# EAGLE design Placa ATMEL 2019 v2 (EAGLE 7.6.0)
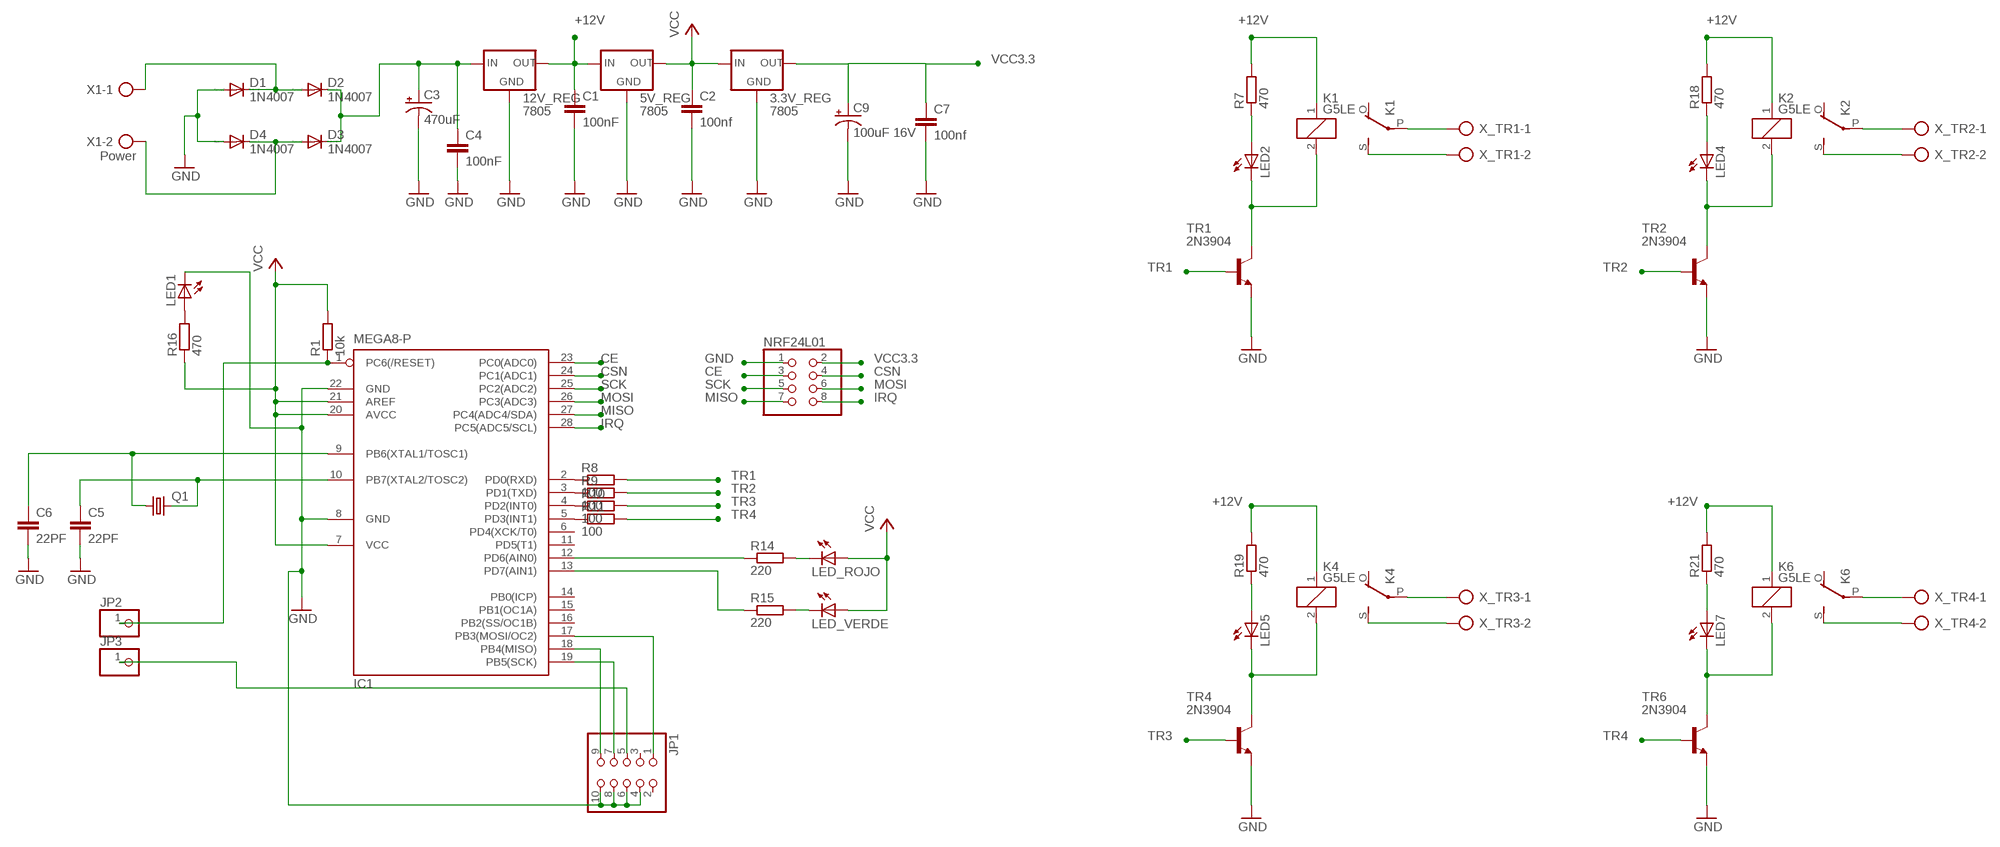
[diagram p0: schematic, sheet 1]

## Parts
3.3V_REG  7805  78XXL  [78XXL]
5V_REG  7805  78XXL  [78XXL]
12V_REG  7805  78XXL  [78XXL]
C1  100nF  C-EU050-025X075  [C050-025X075]
C2  100nf  C-EU050-025X075  [C050-025X075]
C3  470uF  CPOL-USE7.5-16  [E7,5-16]
C4  100nF  C-EU050-025X075  [C050-025X075]
C5  22PF  C-EU050-024X044  [C050-024X044]
C6  22PF  C-EU050-024X044  [C050-024X044]
C7  100nf  C-EU050-025X075  [C050-025X075]
C9  100uF 16V  CPOL-USE2.5-7  [E2,5-7]
D1  1N4007  1N4004  [DO41-10]
D2  1N4007  1N4004  [DO41-10]
D3  1N4007  1N4004  [DO41-10]
D4  1N4007  1N4004  [DO41-10]
IC1  MEGA8-P  [DIL28-3]
JP1  PINHD-2X5  [2X05]
JP2  PINHD-1X1  [1X01]
JP3  PINHD-1X1  [1X01]
K1  G5LE  [G5LE]
K2  G5LE  [G5LE]
K4  G5LE  [G5LE]
K6  G5LE  [G5LE]
LED1  LED5MM  [LED5MM]
LED2  LED5MM  [LED5MM]
LED4  LED5MM  [LED5MM]
LED5  LED5MM  [LED5MM]
LED7  LED5MM  [LED5MM]
LED_ROJO  LED5MM  [LED5MM]
LED_VERDE  LED5MM  [LED5MM]
NRF24L01  PINHD-2X4  [2X04]
Q1  CRYSTALHC49S  [HC49/S]
R1  10k  R-EU_0207/10  [0207/10]
R7  470  R-EU_0309/10  [0309/10]
R8  100  R-EU_0207/10  [0207/10]
R9  100  R-EU_0207/10  [0207/10]
R10  100  R-EU_0207/15  [0207/15]
R11  100  R-EU_0207/10  [0207/10]
R14  220  R-EU_0207/10  [0207/10]
R15  220  R-EU_0207/10  [0207/10]
R16  470  R-EU_0309/10  [0309/10]
R18  470  R-EU_0309/10  [0309/10]
R19  470  R-EU_0309/10  [0309/10]
R21  470  R-EU_0309/10  [0309/10]
TR1  2N3904  [TO92]
TR2  2N3904  [TO92]
TR4  2N3904  [TO92]
TR6  2N3904  [TO92]
X1  Power  AK500/2  [AK500/2]
X_TR1  AK300/2  [AK300/2]
X_TR2  AK300/2  [AK300/2]
X_TR3  AK300/2  [AK300/2]
X_TR4  AK300/2  [AK300/2]

## Nets
+12V: 5V_REG.IN 12V_REG.OUT C1.1 K1.1 K2.1 K4.1 K6.1 R7.2 R18.2 R19.2 R21.2
CE: IC1.23(PC0(ADC0)) NRF24L01.3
CSN: IC1.24(PC1(ADC1)) NRF24L01.4
GND: 3.3V_REG.GND 5V_REG.GND 12V_REG.GND C1.2 C2.2 C3.- C4.2 C5.2 C6.2 C7.2 C9.- D1.A D4.A IC1.8(GND) IC1.22(GND) JP1.4 JP1.6 JP1.8 JP1.10 LED1.K(C) NRF24L01.1 TR1.3(E) TR2.3(E) TR4.3(E) TR6.3(E)
IRQ: IC1.28(PC5(ADC5/SCL)) NRF24L01.8
MISO: IC1.27(PC4(ADC4/SDA)) NRF24L01.7
MOSI: IC1.26(PC3(ADC3)) NRF24L01.6
N$1: JP1.5 JP3.1
N$2: 12V_REG.IN C3.+ C4.1 D2.C D3.C
N$3: K4.S(2:S) X_TR3.2
N$4: K1.S(2:S) X_TR1.2
N$5: K2.S(2:S) X_TR2.2
N$6: LED2.A R7.1
N$7: IC1.2(PD0(RXD)) R8.1
N$8: IC1.3(PD1(TXD)) R9.1
N$9: IC1.4(PD2(INT0)) R10.1
N$10: IC1.5(PD3(INT1)) R11.1
N$11: LED_ROJO.K(C) R14.2
N$12: LED_VERDE.K(C) R15.2
N$13: IC1.12(PD6(AIN0)) R14.1
N$14: IC1.13(PD7(AIN1)) R15.1
N$15: K6.S(2:S) X_TR4.2
N$16: IC1.17(PB3(MOSI/OC2)) JP1.1
N$17: LED1.A R16.2
N$18: IC1.19(PB5(SCK)) JP1.7
N$19: IC1.18(PB4(MISO)) JP1.9
N$24: D1.C D2.A X1.1
N$29: K1.2 LED2.K(C) TR1.1(C)
N$32: K1.P(2:P) X_TR1.1
N$65: D3.A D4.C X1.2
N$71: LED4.A R18.1
N$81: K2.2 LED4.K(C) TR2.1(C)
N$84: K2.P(2:P) X_TR2.1
N$85: LED5.A R19.1
N$86: K4.2 LED5.K(C) TR4.1(C)
N$89: K4.P(2:P) X_TR3.1
N$111: IC1.1(PC6(/RESET)) JP2.1 R1.1
N$118: LED7.A R21.1
N$135: C5.1 IC1.10(PB7(XTAL2/TOSC2)) Q1.2
N$136: C6.1 IC1.9(PB6(XTAL1/TOSC1)) Q1.1
N$138: K6.2 LED7.K(C) TR6.1(C)
N$148: K6.P(2:P) X_TR4.1
SCK: IC1.25(PC2(ADC2)) NRF24L01.5
TR1: R8.2 TR1.2(B)
TR2: R9.2 TR2.2(B)
TR3: R10.2 TR4.2(B)
TR4: R11.2 TR6.2(B)
VCC: 3.3V_REG.IN 5V_REG.OUT C2.1 IC1.7(VCC) IC1.20(AVCC) IC1.21(AREF) LED_ROJO.A LED_VERDE.A R1.2 R16.1
VCC3.3: 3.3V_REG.OUT C7.1 C9.+ NRF24L01.2
Unconnected: IC1.6(PD4(XCK/T0)) IC1.11(PD5(T1)) IC1.14(PB0(ICP)) IC1.15(PB1(OC1A)) IC1.16(PB2(SS/OC1B)) JP1.2 JP1.3 K1.O(2:O) K2.O(2:O) K4.O(2:O) K6.O(2:O)

## Library data of the parts
3.3V_REG 5V_REG 12V_REG = v-reg:78XXL: VOLTAGE REGULATOR
C1 C2 C4-C7 = rcl:C-EU: CAPACITOR, European symbol
C3 C9 = rcl:CPOL-US: POLARIZED CAPACITOR, American symbol
D1-D4 = diode:1N4004: DIODE general purpose rectifier, 1 A
IC1 = atmel:MEGA8-P: MICROCONTROLLER 8 Kbytes FLASH, 1 kbytes SRAM, 512 bytes EEPROM, USART, 4-channel 10 bit ADC, 2-channel 8 bit ADC Pin compatible with Atmega48, ATMega88, ATMega168 Source: avr.lbr; OC_FARNELL: unknown; OC_NEWARK: unknown
JP1 = pinhead:PINHD-2X5: PIN HEADER
JP2 JP3 = pinhead:PINHD-1X1: PIN HEADER
K1 K2 K4 K6 = relay:G5LE: RELAY 1 x switch, 10 A/120 V AC, 8 A/30 V DC, Omron; OC_FARNELL: unknown; OC_NEWARK: unknown
LED1 LED2 LED4 LED5 LED7 LED_ROJO LED_VERDE = led:LED: LED OSRAM: - CHIPLED LG R971, LG N971, LY N971, LG Q971, LY Q971, LO R971, LY R971 LH N974, LH R974 LS Q976, LO Q976, LY Q976 LO Q996 - Hyper CHIPLED LW Q18S LB Q993, LB Q99A, LB R99A - SideLED LS A670, LO A670, LY A670, LG A670, LP A670 LB A673, LV A673, LT A673, LW A673 LH A674 LY A675 LS A676, LA A676, LO A676, LY A676, LW A676 LS A679, LY A679, LG A679 - Hyper Micro SIDELED® LS Y876, LA Y876, LO Y876, LY Y876 LT Y87S - SmartLED LW L88C, LW L88S LB L89C, LB L89S, LG L890 LS L89K, LO L89K, LY L89K LS L896, LA L896, LO L896, LY L896 - TOPLED LS T670, LO T670, LY T670, LG T670, LP T670 LSG T670, LSP T670, LSY T670, LOP T670, LYG T670 LG T671, LOG T671, LSG T671 LB T673, LV T673, LT T673, LW T673 LH T674 LS T676, LA T676, LO T676, LY T676, LB T676, LH T676, LSB T676, LW T676 LB T67C, LV T67C, LT T67C, LS T67K, LO T67K, LY T67K, LW E67C LS E67B, LA E67B, LO E67B, LY E67B, LB E67C, LV E67C, LT E67C LW T67C LS T679, LY T679, LG T679 LS T770, LO T770, LY T770, LG T770, LP T770 LB T773, LV T773, LT T773, LW T773 LH T774 LS E675, LA E675, LY E675, LS T675 LS T776, LA T776, LO T776, LY T776, LB T776 LHGB T686 LT T68C, LB T68C - Hyper Mini TOPLED® LB M676 - Mini TOPLED Santana® LG M470 LS M47K, LO M47K, LY M47K Source: http://www.osram.convergy.de LUXEON: - LUMILED® LXK2-PW12-R00, LXK2-PW12-S00, LXK2-PW14-U00, LXK2-PW14-V00 LXK2-PM12-R00, LXK2-PM12-S00, LXK2-PM14-U00 LXK2-PE12-Q00, LXK2-PE12-R00, LXK2-PE12-S00, LXK2-PE14-T00, LXK2-PE14-U00 LXK2-PB12-K00, LXK2-PB12-L00, LXK2-PB12-M00, LXK2-PB14-N00, LXK2-PB14-P00, LXK2-PB14-Q00 LXK2-PR12-L00, LXK2-PR12-M00, LXK2-PR14-Q00, LXK2-PR14-R00 LXK2-PD12-Q00, LXK2-PD12-R00, LXK2-PD12-S00 LXK2-PH12-R00, LXK2-PH12-S00 LXK2-PL12-P00, LXK2-PL12-Q00, LXK2-PL12-R00 Source: www.luxeon.com KINGBRIGHT: KA-3528ASYC Source: www.kingbright.com
NRF24L01 = pinhead:PINHD-2X4: PIN HEADER
Q1 = crystal:CRYSTAL: CRYSTAL; OC_FARNELL: 1667008; OC_NEWARK: unknown
R1 R7-R11 R14-R16 R18 R19 R21 = rcl:R-EU_: RESISTOR, European symbol
TR1 TR2 TR4 TR6 = transistor-npn:2N3904: NPN Transistor
X1 = con-ptr500:AK500/2: CONNECTOR; OC_FARNELL: unknown; OC_NEWARK: unknown
X_TR1-X_TR4 = con-ptr500:AK300/2: CONNECTOR; OC_FARNELL: unknown; OC_NEWARK: unknown

## Board
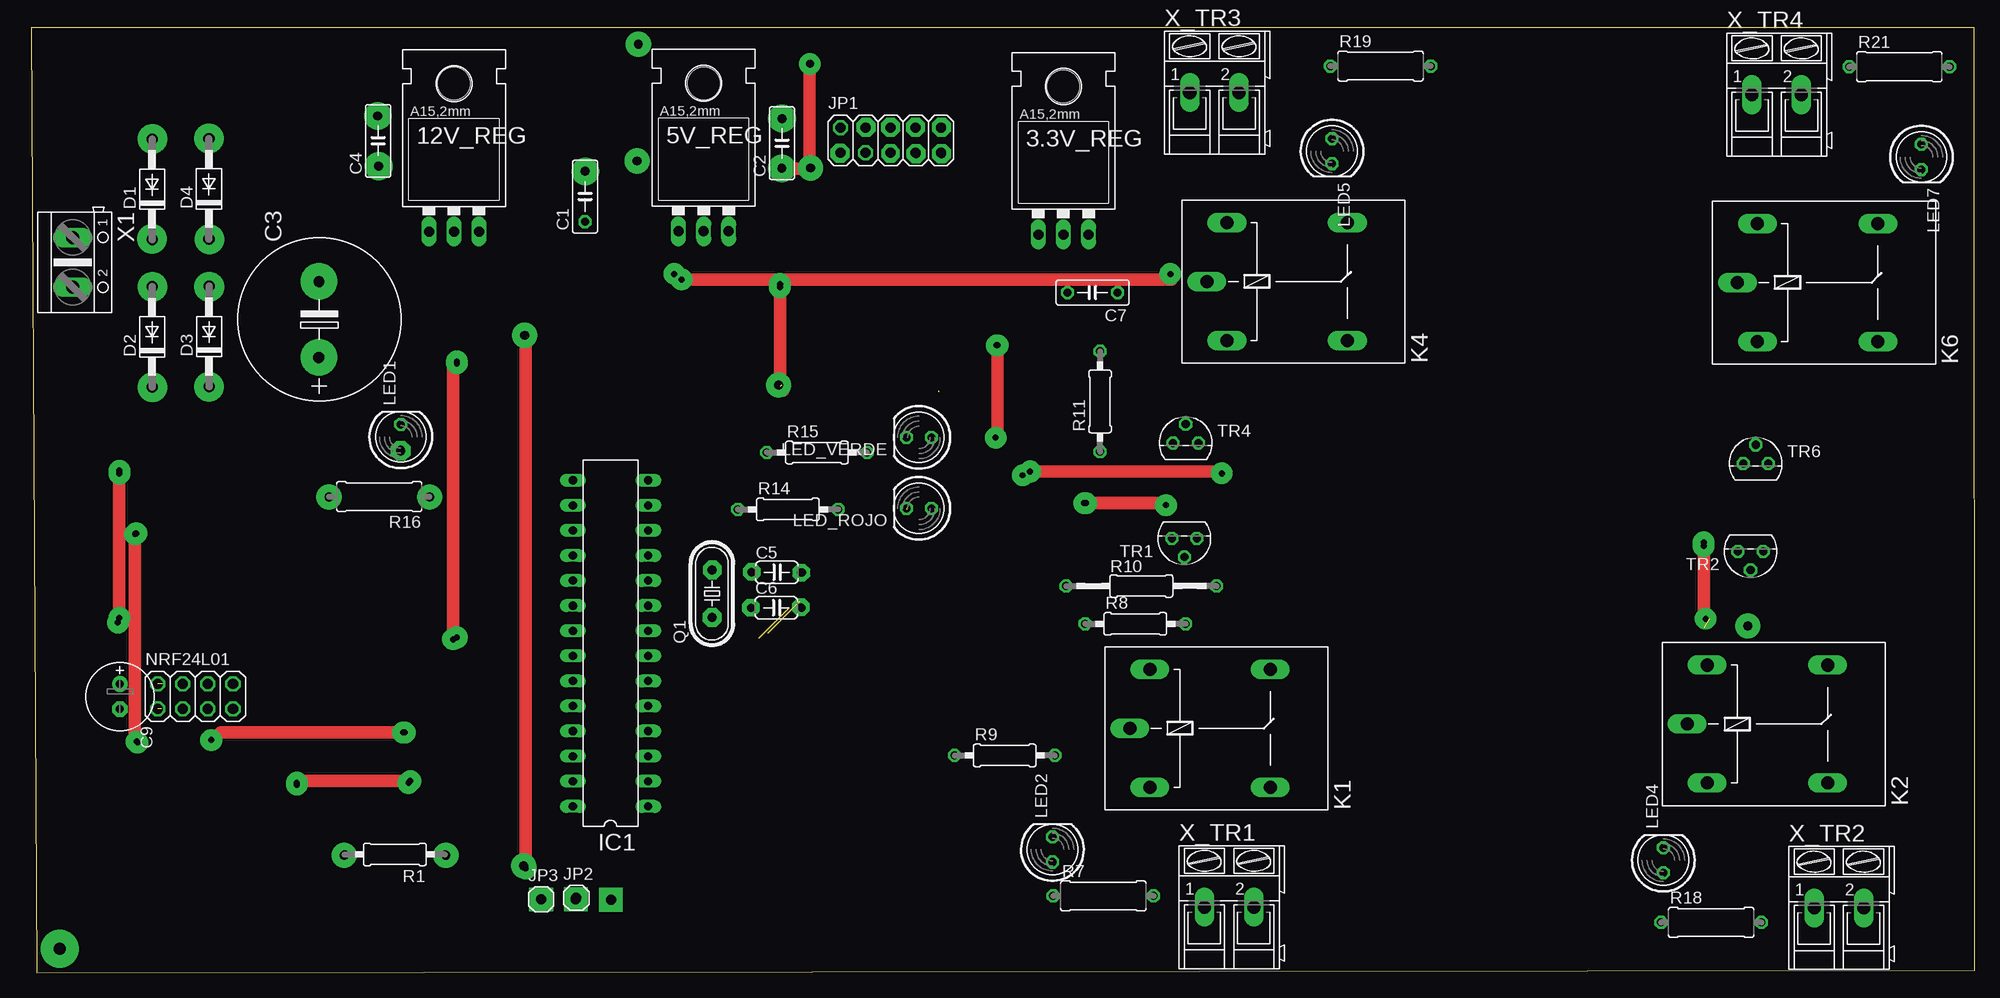
[diagram p1: board, top side]
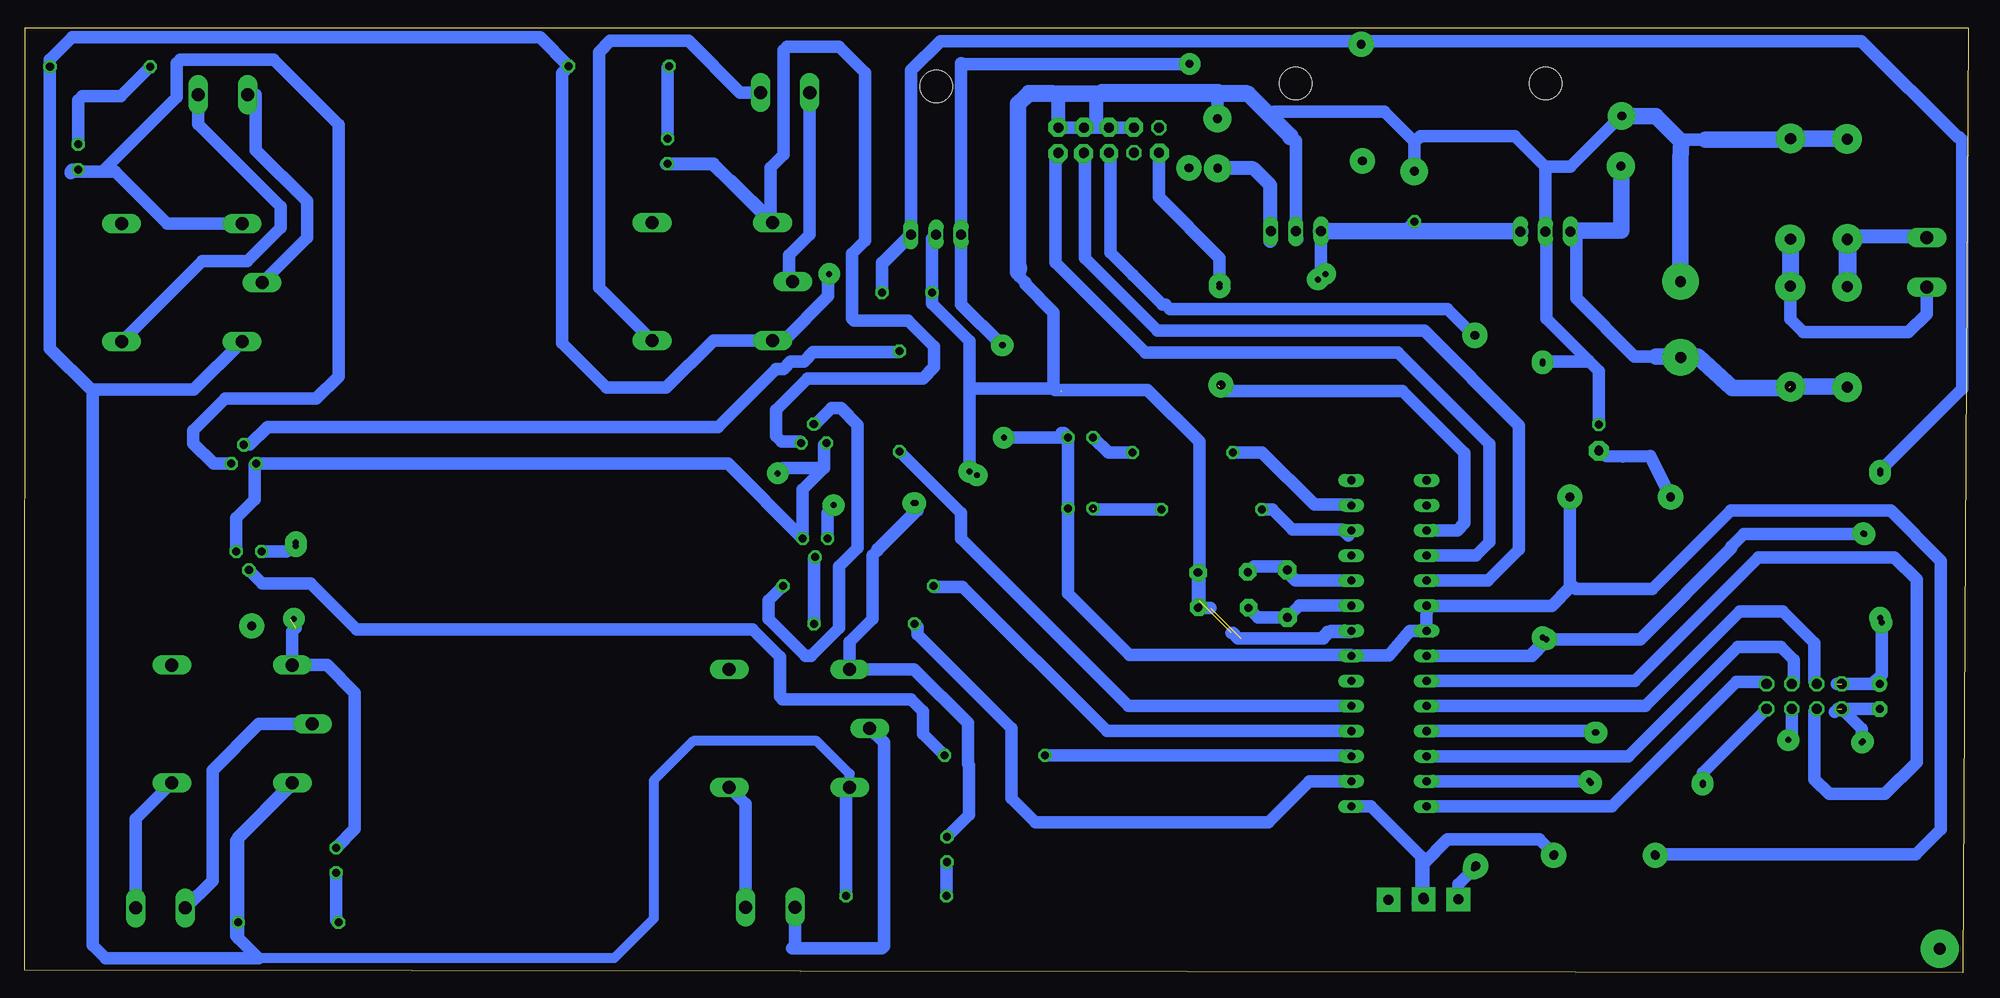
[diagram p2: board, bottom side, seen from below]

Size 196.74 x 95.72 mm. Coordinates in mm from the lower left corner, seen from the top.
Outline: 0.57,0 196.74,0.28 196.7,95.72 0,95.7 0.57,0
Copper layers (1*16): Top 0.035mm / dielectric 1.5mm / Bottom 0.035mm
Design rules "default *": minimum track width 10mil, minimum drill 24mil, track to track 1mm, track to pad 1mm, pad to pad 1mm, via to via 1mm, smd to smd 1mm, copper to edge 1mm, drill to drill 1mm, minimum pad ring 10mil, minimum via ring 8mil, stop-mask expansion 4mil, vias tented up to drill 0mil, thermal gap 10mil

### Footprints (pad centres in the part's own frame; a part is rotated, then mirrored left to right if it is on the bottom)
78XXL = drill 1.016 long: GND 0,-3.81; IN -2.54,-3.81; OUT 2.54,-3.81 | hole 3.302: 0,11.176
C050-025X075 = drill 0.813 octagon: 1 -2.54,0; 2 2.54,0
E7,5-16 = drill 1.016 pad 3.15: + -3.81,0 | drill 1.016 pad 3.15 octagon: - 3.81,0
C050-024X044 = drill 0.813 octagon: 1 -2.54,0; 2 2.54,0
E2,5-7 = drill 0.813 pad 1.6: + -1.27,0 | drill 0.813 pad 1.6 octagon: - 1.27,0
DO41-10 = drill 1.118: A 5.08,0; C -5.08,0
DIL28-3 = drill 0.813 long: 1 -16.51,-3.81; 2 -13.97,-3.81; 3 -11.43,-3.81; 4 -8.89,-3.81; 5 -6.35,-3.81; 6 -3.81,-3.81; 7 -1.27,-3.81; 8 1.27,-3.81; 9 3.81,-3.81; 10 6.35,-3.81; 11 8.89,-3.81; 12 11.43,-3.81; 13 13.97,-3.81; 14 16.51,-3.81; 15 16.51,3.81; 16 13.97,3.81; 17 11.43,3.81; 18 8.89,3.81; 19 6.35,3.81; 20 3.81,3.81; 21 1.27,3.81; 22 -1.27,3.81; 23 -3.81,3.81; 24 -6.35,3.81; 25 -8.89,3.81; 26 -11.43,3.81; 27 -13.97,3.81; 28 -16.51,3.81
2X05 = drill 1.016 octagon: 1 -5.08,-1.27; 2 -5.08,1.27; 3 -2.54,-1.27; 4 -2.54,1.27; 5 0,-1.27; 6 0,1.27; 7 2.54,-1.27; 8 2.54,1.27; 9 5.08,-1.27; 10 5.08,1.27
1X01 = drill 1.016 octagon: 1 0,0
G5LE = drill 1.321 long: 1 -7.493,-5.969; 2 -7.493,5.969; O 4.699,5.969; P -9.525,0; S 4.699,-5.969
LED5MM = drill 0.813 octagon: A -1.27,0; K 1.27,0
2X04 = drill 1.016 octagon: 1 -3.81,-1.27; 2 -3.81,1.27; 3 -1.27,-1.27; 4 -1.27,1.27; 5 1.27,-1.27; 6 1.27,1.27; 7 3.81,-1.27; 8 3.81,1.27
HC49/S = drill 0.813: 1 -2.413,0; 2 2.413,0
0207/10 = drill 0.813 octagon: 1 -5.08,0; 2 5.08,0
0309/10 = drill 0.813 octagon: 1 -5.08,0; 2 5.08,0
0207/15 = drill 0.813 octagon: 1 -7.62,0; 2 7.62,0
TO92 = drill 0.813 octagon: 1 1.27,0; 2 0,1.905; 3 -1.27,0
AK500/2 = drill 1.321 long: 1 -2.515,0; 2 2.515,0
AK300/2 = drill 1.321 long: 1 -2.515,0; 2 2.489,0

### Placement (x,y rotation side)
3.3V_REG  104.48,78.59 0 top
5V_REG  68.06,78.91 0 top
12V_REG  42.79,78.88 0 top
C1  56.05,78.61 90 top
C2  75.98,84.02 90 top
C3  29.15,66.17 90 top
C4  35.11,84.26 90 top
C5  75.47,40.56 0 top
C6  75.42,36.98 0 top
C7  107.43,68.9 180 top
C9  8.97,27.99 270 top
D1  12.22,79.36 90 top
D2  12.23,64.42 90 top
D3  17.99,64.45 90 top
D4  17.98,79.4 90 top
IC1  58.63,33.38 90 top
JP1  86.99,84.31 0 top
JP2  55.17,7.6 0 top
JP3  51.62,7.46 0 top
K1  120.73,24.78 0 top
K2  177.15,25.2 0 top
K4  128.53,70.02 0 top
K6  182.23,69.92 0 top
LED1  37.4,54.28 90 top
LED2  103.37,12.5 90 top
LED4  165.21,11.42 90 top
LED5  131.67,83.22 270 top
LED7  191.34,82.63 270 top
LED_ROJO  89.85,47.05 180 top
LED_VERDE  89.85,54.23 180 top
NRF24L01  16.6,28 0 top
Q1  68.9,38.41 90 top
R1  36.8,12 180 top
R7  108.52,7.8 0 top
R8  111.76,35.35 0 top
R9  98.54,22.03 0 top
R10  112.37,39.18 0 top
R11  108.19,57.87 90 top
R14  76.59,46.94 0 top
R15  79.52,52.7 0 top
R16  35.22,48.24 180 top
R18  170.05,5.12 0 top
R19  136.58,91.83 0 top
R21  189.1,91.76 0 top
TR1  116.72,44.01 180 top
TR2  174.04,42.7 180 top
TR4  116.86,53.66 0 top
TR6  174.56,51.58 0 top
X1  4.19,71.96 270 top
X_TR1  121.26,6.66 0 top
X_TR2  182.99,6.58 0 top
X_TR3  119.78,89.14 0 top
X_TR4  176.7,88.93 0 top

### Tracks (layer width: path | path; a pad name or v marks a point on that pad's centre or on a via)
+12V  (via drill 0.6 pad 2.18)  (1 unrouted)
  Top 1.27: v65.83,70.22 115.41,70.22 115.42,70.21
  Bottom 1.016: K1.1 113.24,20.17 116.57,23.5 129.07,23.5 133.07,19.5 133.07,5.5 137.07,1.5 173.06,1.5 173.07,1.51
  Bottom 1.27: 173.46,1.86 175.13,3.53 R18.2 175.13,13.76 K2.1 169.66,19.07 175.33,13.4 175.33,3.77 173.07,1.51 188.52,1.51 189.84,2.83 189.84,58.7 189.46,59.08 | C1.1 57.02,75.1 60.56,75.1 | R7.2 113.6,18.45 K1.1 | 189.46,59.08 190.03,59.08 194.18,63.23 R21.2 194.18,92.48 191.91,94.75 144.58,94.75 R19.2 142.36,91.13 142.36,63.8 137.83,59.27 131.81,59.27 127.03,64.05 K4.1 119.89,64.05 115.42,68.52 115.42,70.21 115.23,70.4 | 189.46,59.08 179.61,59.08 K6.1 | 5V_REG.IN 65.52,70.84 65.27,70.59 65.46,70.59 v65.83,70.22
  Bottom 1.676: 5V_REG.IN 60.56,75.1 45.33,75.1 12V_REG.OUT
CE
  Bottom 1.27: IC1.23 33.75,29.57 21.23,42.09 7.47,42.09 5.21,39.83 5.21,21.33 8.42,18.12 14.07,18.12 15.58,19.63 15.58,26.48 NRF24L01.3
CSN
  Bottom 1.27: IC1.24 32.7,27.03 23.11,36.62 18.79,36.62 15.58,33.41 15.58,29.52 NRF24L01.4
GND  (via drill 0.6 pad 2.18)  (4 unrouted)
  Top 1.27: v42.7,33.79 42.7,61.53 v43.08,61.91 | v101.11,50.78 120.32,50.78 120.7,50.4 | v10.49,44.44 10.49,23.6 v10.76,23.33
  Bottom 1.27: JP1.4 JP1.6 87.98,85.58 | 87.98,85.58 JP1.8 JP1.10 92.07,88.63 92.7,89.26 95.19,89.26 96.1,88.35 96.1,70.54 95.45,69.89 95.45,69.76 92.57,66.88 92.57,59.16 | C5.2 77.97,39.82 C6.2 76.7,36.98 | 3.3V_REG.GND 104.89,74.37 C7.2 104.89,67.77 101.11,63.99 101.11,59.42 | 5V_REG.GND 68.06,84.28 70.59,86.81 | 70.59,86.81 73.06,89.28 75.78,89.28 75.98,89.08 C2.2 75.98,89.3 75.89,89.39 87.75,89.39 88.19,88.95 88.19,85.79 87.98,85.58 | 26.61,84.38 28.83,84.38 29.02,84.19 | C1.2 56.05,84.16 | 56.05,84.16 59.09,87.2 70.21,87.2 70.59,86.81 | 42.79,81.63 12V_REG.GND 42.7,74.98 42.7,66.25 38.46,62.01 | 42.79,81.63 45.91,84.75 55.46,84.75 56.05,84.16 | 42.79,81.63 40.28,81.63 C4.2 | LED1.K 37.4,60.95 38.46,62.01 | v43.08,61.91 38.56,61.91 38.46,62.01 | C9.- 13.21,26.72 13.5,26.43 | TR2.3 175.31,46.08 173.45,47.94 173.45,51.42 TR6.3 125.56,51.58 TR1.3 117.99,48.96 115.8,51.15 | 115.8,51.15 115.8,53.45 TR4.3 | 101.11,59.42 v101.11,50.78 100.35,50.02 | 115.8,51.15 119.95,51.15 120.7,50.4 | 73.62,33.9 65.51,33.9 64.86,34.55 62.54,34.55 IC1.8 64.53,34.65 65.28,33.9 73.91,33.9 74.43,34.42 74.56,34.42 | 42.9,33.64 44.43,32.11 IC1.22 44.19,32.11 42.89,33.41 42.89,33.6 v42.7,33.79 33.21,33.79 23.98,43.02 23.98,43.19 22.73,44.44 10.64,44.44 10.49,44.59 v10.49,44.44 | 92.57,59.16 100.85,59.16 101.11,59.42 | 77.83,37.69 77.83,53.8 83.06,59.03 92.44,59.03 92.57,59.16 | v10.76,23.33 10.76,24.7 NRF24L01.1
  Bottom 1.422: 42.83,74.71 12V_REG.GND
  Bottom 1.676: D1.A 12.26,84.48 D4.A 18.08,84.38 26.61,84.38 | C3.- 29.16,82.41 29.02,84.19 31.62,86.75 34.93,86.75 C4.2
IRQ
  Bottom 1.27: IC1.28 36.07,16.87 23.49,29.45 20.59,29.45 NRF24L01.8
MISO  (via drill 0.6 pad 2.18)
  Top 1.27: v38.37,19.44 27.26,19.44 v26.88,19.06
  Bottom 1.27: IC1.27 38.15,19.41 37.99,19.25 v38.18,19.25 v38.37,19.44 | v26.88,19.06 26.88,20.26 NRF24L01.7
MOSI
  Bottom 1.27: IC1.26 34.38,21.95 23.3,33.03 18.97,33.03 17.65,31.71 17.65,29.49 NRF24L01.6
N$1  (via drill 0.6 pad 2.18)  (1 unrouted)
  Top 1.27: v50.05,10.57 50.05,64.26 50.19,64.4
  Bottom 1.27: JP1.5 86.82,82.68 86.82,72.94 84.56,70.68 84.56,70.67 81.58,67.69 81.26,67.69 80.79,67.22 52.7,67.22 50.03,64.55 50.19,64.39 50.19,64.4 49.88,64.71 | JP3.1 51.62,9 v50.05,10.57 50.05,10.76 50.05,10.95
N$2  (1 unrouted)
  Bottom 1.27: 31.64,62.44 33.8,62.44 39.69,68.33 39.69,75.17
  Bottom 1.422: C3.+ 29.43,62.64 | 12V_REG.IN 40.21,75.11
  Bottom 1.676: D2.C 12.26,59.37 D3.C | 18.14,59.22 23.87,59.22 27.37,62.41 C3.+ | 29.43,62.64 29.63,62.44 31.64,62.44 | C4.1 35.11,75.17 39.69,75.17 40.15,75.17 40.21,75.11
N$3
  Bottom 1.27: X_TR3.2 124.31,89.14 129.55,94.38 137.46,94.38 138.6,93.24 138.6,69.42 K4.S
N$4
  Bottom 1.27: X_TR1.2 123.75,17.13 K1.S
N$5
  Bottom 1.27: X_TR2.2 185.48,15.6 K2.S
N$6
  Bottom 1.27: LED2.A 103.44,11.16 R7.1
N$7
  Bottom 1.27: R8.1 106.35,35.02 106.35,34.27 96.84,24.76 96.84,17.67 94.43,15.26 70.85,15.26 66.7,19.41 IC1.2
N$8
  Bottom 1.27: IC1.3 62.52,22.03 R9.1
N$9
  Bottom 1.27: IC1.4 87.2,24.49 101.82,39.11 104.68,39.11 R10.1
N$10
  Bottom 1.27: IC1.5 85.03,27.03 101.98,43.98 101.98,46.58 R11.1
N$11  (1 unrouted)
  Bottom 1.27: 88.62,46.94 88.64,46.96 | R14.2 88.47,46.94 LED_ROJO.K
N$12
  Bottom 1.27: R15.2 87.05,52.7 LED_VERDE.K
N$13
  Bottom 1.27: R14.1 70.42,46.94 68.4,44.92 63.38,44.92 62.75,44.29 62.75,44.3 62.9,44.45 62.8,44.45 IC1.12
N$14
  Bottom 1.27: R15.1 71.47,52.7 66.2,47.43 62.52,47.43 IC1.13
N$15
  Bottom 1.27: X_TR4.2 179.19,85.96 170.81,77.58 170.81,75.49 174.2,72.1 178.78,72.1 K6.S
N$16  (via drill 0.6 pad 2.18)  (1 unrouted)
  Top 1.27: v75.78,69.44 75.78,59.38 75.74,59.34 | 75.74,59.34 75.63,59.23 75.85,59.23 | 75.85,59.23 76.11,58.98 | 75.85,59.23 75.74,59.34
  Bottom 1.27: IC1.17 51.72,44.81 50.98,45.55 50.98,52.63 57.25,58.9 75.3,58.9 75.93,59.53 | JP1.1 81.91,78.54 75.77,72.4 v75.77,69.45 v75.78,69.44
N$17
  Bottom 1.27: R16.2 32.18,52.34 34.96,52.31 36.65,52.33 LED1.A
N$18
  Bottom 1.27: IC1.19 48.63,39.73 45.48,42.88 45.48,55.45 55.06,65.03 82.06,65.03 89.43,72.4 89.43,82.94 JP1.7
N$19
  Bottom 1.27: IC1.18 49.86,42.27 48.47,43.66 48.47,53.57 57.72,62.82 83.3,62.82 92.41,71.93 92.41,82.7 JP1.9
N$20  (via drill 0.6 pad 2.18)
  other vias: 97.62,54.21
N$21  (via drill 0.6 pad 2.18)
  other vias: 97.72,63.56
N$22  (via drill 0.6 pad 2.18)
  other vias: 26.88,19.25
N$23  (via drill 0.9 pad 2)
  other vias: 37.38,52.87
N$24
  Bottom 1.27: X1.1 4.13,74.55 | 11.89,74.28 D1.C
  Bottom 1.422: 4.13,74.55 12.22,74.55 D1.C
  Bottom 1.8: D1.C D2.A
N$25  (via drill 0.6 pad 2.18)
  other vias: 37.62,24.35
N$26  (via drill 0.6 pad 2.18)
  other vias: 18.21,23.59
N$27  (via drill 0.6 pad 2.18)
  other vias: 43.08,33.98
N$28  (via drill 0.6 pad 2.18)
  other vias: 43.08,61.72
N$29  (via drill 0.6 pad 2.18)  (1 unrouted)
  Top 1.27: v106.57,47.57 114.86,47.57 115.05,47.38
  Bottom 1.27: LED2.K 101.13,16.01 101.13,21.02 101.26,21.15 101.26,25.3 106.71,30.75 K1.2 113.24,33.52 110.9,35.86 110.9,42.29 110.43,42.76 | 110.43,42.76 106.38,46.81 106.38,47 | TR1.1 115.45,46.6 115.05,47 115.05,47.38 | 110.43,42.76 110.43,42.95 106.38,47 | 106.38,47 106.38,47.38 v106.57,47.57
N$30  (via drill 0.9 pad 2.54)
  other vias: 78.89,81.52
N$31  (via drill 0.6 pad 2.18)
  other vias: 106.76,47.57
N$32
  Bottom 1.27: K1.P 109.76,23.34 109.76,2.7 109.95,2.51 119.06,2.51 118.74,2.83 X_TR1.1
N$33  (via drill 0.6 pad 2.18)
  other vias: 114.86,47.38
N$34  (via drill 0.6 pad 2.18)
  other vias: 169.3,43.22
N$35  (via drill 0.6 pad 2.18)
  other vias: 169.49,35.86
N$36  (via drill 0.6 pad 2.18)
  other vias: 120.51,50.59
N$38  (via drill 0.9 pad 2.54)
  other vias: 49.85,10.86
N$41  (via drill 1.2 pad 3.81)
  other vias: 2.87,2.45
N$42  (via drill 0.6 pad 2.18)
  other vias: 100.35,50.4
N$43  (via drill 0.9 pad 1.93)
  other vias: 89.49,85.63
N$44  (via drill 0.6 pad 2.18)
  other vias: 115.31,70.78
N$46  (via drill 0.9 pad 2.54)
  other vias: 31.65,11.91
N$47  (via drill 0.9 pad 2.54)
  other vias: 41.97,11.93
N$49  (via drill 0.6 pad 2.18)
  other vias: 65.08,70.78
N$50  (via drill 0.6 pad 2.18)
  other vias: 75.78,69.77
N$51  (via drill 0.6 pad 2.18)
  other vias: 8.92,35.96
N$52  (via drill 0.9 pad 2.54)
  other vias: 75.64,59.53
N$53
  Bottom 1.27: 68.04,74.43 67.92,74.31
N$54
  Bottom 1.422: 52.16,7.11 51.16,7.1
N$55  (via drill 0.9 pad 1.93)
  other vias: 92.15,82.94
N$56  (via drill 0.9 pad 1.93)
  other vias: 81.86,83.01
N$59  (via drill 0.9 pad 1.93)
  other vias: 89.55,82.96
N$60  (via drill 0.9 pad 1.93)
  other vias: 86.99,85.63
N$61  (via drill 0.9 pad 1.93)
  other vias: 92.12,85.63
N$62  (via drill 0.6 pad 2.18)
  other vias: 8.92,50.56
N$64  (via drill 0.9 pad 1.85)
  other vias: 86.98,82.98
N$65
  Bottom 1.27: X1.2 4.18,69.47 4.18,66.7 6.09,64.88 16.68,64.88 17.99,66.19 D3.A
  Bottom 1.7: D3.A D4.C
N$66  (via drill 0.6 pad 2.18)
  other vias: 10.62,44.51
N$67
  Bottom 1.422: 54.66,7.07 55.7,7.08
N$69  (via drill 0.6 pad 2.18)
  other vias: 10.65,23.44
N$71
  Bottom 1.27: R18.1 165.21,5.36 LED4.A
N$81  (via drill 0.6 pad 2.18)  (1 unrouted)
  Top 1.27: v169.3,43.6 169.3,36.43 169.87,35.86
  Bottom 1.27: LED4.K 163.32,14.58 163.32,28.35 166.14,31.17 K2.2 169.66,34.56 169.3,34.92 | TR2.1 170.2,42.7 v169.3,43.6
N$84
  Bottom 1.27: X_TR2.1 177.73,9.32 177.73,20.54 173.07,25.2 K2.P
N$85
  Bottom 1.27: R19.1 131.67,91.66 LED5.A
N$86
  Bottom 1.27: LED5.K 127,81.95 K4.2 121.17,75.99 127.1,81.92 127.11,81.92 | 131.81,81.92 127.11,81.92 | 127.11,81.92 125.41,80.22 125.22,80.22 121.26,76.26 121.26,81.54 119.94,82.86 119.94,93.44 119.57,93.81 114.3,93.81 111.66,91.17 111.66,74.17 112.97,72.86 112.97,66.24 112.79,66.06 107.32,66.06 104.68,63.42 104.68,61.35 105.82,60.21 117.49,60.21 120.7,57 120.7,54.36 120.13,53.79 118.26,53.79 TR4.1
N$87  (via drill 0.9 pad 2.54)
  other vias: 173.77,35.14
N$89
  Bottom 1.27: 118.2,70.02 K4.P 119.38,70.39 119.38,72.67 117.26,74.78 X_TR3.1
N$94  (via drill 0.9 pad 2.54)
  other vias: 49.95,64.57
N$95
  Bottom 1.422: 58.24,6.99 59.21,6.99
N$101  (via drill 1 pad 3)
  other vias: 12.25,84.45
N$102  (via drill 1 pad 3)
  other vias: 17.99,84.5
N$103  (via drill 1 pad 3)
  other vias: 18.02,74.29
N$104  (via drill 1 pad 3)
  other vias: 12.22,74.35
N$105  (via drill 1 pad 3)
  other vias: 18,69.48
N$106  (via drill 1 pad 3)
  other vias: 12.25,69.48
N$107  (via drill 1 pad 3)
  other vias: 17.97,59.36
N$108  (via drill 1 pad 3)
  other vias: 12.25,59.29
N$111
  Bottom 1.27: IC1.1 60.46,16.87 55.37,11.78 55.37,7.8 JP2.1 55.17,11.04 52.7,13.51 43.39,13.51 R1.1
N$114  (via drill 1 pad 2.4)
  other vias: 51.61,7.44
N$115  (via drill 1 pad 2.4)
  other vias: 55.11,7.45
N$117
  Top 0.61: 50.19,10.99 49.7,9.96
N$118
  Bottom 1.27: R21.1 187.01,88.77 190.94,88.77 191.34,88.37 LED7.A
N$120  (via drill 1 pad 2.4)
  other vias: 58.68,7.41
N$124  (via drill 0.9 pad 2.8)
  other vias: 35.08,86.78
N$125  (via drill 0.9 pad 2.8)
  other vias: 35.16,81.69
N$126  (via drill 0.9 pad 2.8)
  other vias: 56.07,81.18
N$127  (via drill 0.9 pad 2.8)
  other vias: 75.99,86.52
N$128  (1 unrouted)
N$129
  Bottom 1.676: 96.1,71.4 96.2,70.98 96.21,88.02 95.01,89.05 72.9,89.05 68.6,84.75 68.6,84.64
N$130
  Bottom 1.422: 88.2,85.67 88.23,85.7 88.23,88.71
N$131  (via drill 0.9 pad 1.93)
  other vias: 84.49,85.66
N$132  (via drill 1.1 pad 3.7)
  other vias: 29.1,62.32
N$133  (via drill 1.1 pad 3.7)
  other vias: 29.11,70.02
N$134
  Bottom 1.422: 92.05,85.79 92.08,85.79 92.08,88.62
N$135
  Bottom 1.27: IC1.10 62.48,39.77 68.08,39.77 68.9,40.59 Q1.2 69.23,41.15 72.32,41.15 72.91,40.56 C5.1
N$136
  Bottom 1.27: C6.1 71.9,36 Q1.1 67.71,37.19 IC1.9
N$137  (via drill 0.8 pad 1.78)
  other vias: 72.84,36.99
N$138
  Bottom 1.27: K6.2 182.31,75.89 187.58,81.16 188.9,81.16 | 188.9,81.16 192.1,81.16 | 192.1,80.97 192.1,81.16 | 192.1,81.16 191.91,81.35 LED7.K | TR6.1 177.63,51.58 179.66,53.61 179.66,54.94 176.46,58.14 167.23,58.14 164.97,60.4 164.97,85.9 171.56,92.49 180.98,92.49 181.36,92.11 181.36,88.7 188.9,81.16
N$139  (via drill 0.9 pad 2.54)
  other vias: 40.32,48.2
N$140  (via drill 0.9 pad 2.54)
  other vias: 30.13,48.19
N$141  (via drill 0.8 pad 1.78)
  other vias: 72.93,40.61
N$142  (via drill 0.8 pad 1.78)
  other vias: 77.93,40.54
N$143  (via drill 0.8 pad 1.78)
  other vias: 77.9,37.03
N$145  (via drill 0.9 pad 1.9)
  other vias: 68.93,40.82
N$146  (via drill 0.9 pad 1.9)
  other vias: 68.91,35.99
N$148
  Bottom 1.27: X_TR4.1 173.34,88.93 173.34,83.31 168.17,78.14 168.17,74.45 K6.P
N$150  (via drill 0.9 pad 2.54)
  other vias: 61.34,82.23
N$151  (via drill 0.9 pad 2.54)
  other vias: 61.45,94.05
N$154  (via drill 0.8 pad 2.18)
  other vias: 78.82,92.05
SCK  (via drill 0.6 pad 2.18)  (1 unrouted)
  Top 1.27: v37.81,24.35 19.15,24.35 18.21,23.41
  Bottom 1.27: IC1.25 37.95,24.49 v37.81,24.35 | NRF24L01.5 17.87,23.75 18.21,23.41
TR1
  Bottom 1.27: R8.2 116.84,41.98 TR1.2
TR2
  Bottom 1.27: R9.2 105.81,24.22 105.81,26.51 107.02,27.72 120,27.72 120.29,28.01 120.29,32.02 123.08,34.81 163.16,34.81 167.8,39.45 172.69,39.45 TR2.2
TR3
  Bottom 1.27: TR4.2 116.67,55.56 115.05,57.19 114.11,57.19 112.41,55.49 112.41,43.03 114.29,41.15 114.29,34.92 117.12,32.09 117.68,32.09 121.45,35.86 121.45,37.72 R10.2
TR4
  Bottom 1.27: TR6.2 173.94,53.48 172.13,55.3 126.56,55.3 120.7,61.16 119.94,61.16 119.19,61.91 117.87,61.91 116.93,62.85 108.29,62.85 R11.2
VCC  (via drill 0.6 pad 2.18, 0.9 pad 2.8)  (2 unrouted)
  Top 1.27: C2.1 76.04,81.42 79.17,81.42 78.8,81.79 78.8,92.49 | v97.81,63.56 97.81,54.12 97.9,54.03
  Bottom 1.27: 78.8,92.49 78.8,92 101.48,92 101.95,92.11 3.3V_REG.IN 101.94,67.69 v97.81,63.56 | 97.9,54.03 97.7,54.23 LED_VERDE.A 91.55,54.66 91.78,54.66 91.12,54 LED_ROJO.A 91.12,38.44 84.88,32.2 62.53,32.2 IC1.7 62.41,32.14 58.63,32.14 56.54,34.65 IC1.21 54.87,35.57 IC1.20 42.14,37.18 40.3,39.02 40.3,39.45 | R16.1 40.3,39.45 | R1.2 5.3,12 2.77,14.53 2.77,41.73 7.85,46.81 24.04,46.81 31.97,38.88 39.73,38.88 40.3,39.45
  Bottom 1.422: 5V_REG.OUT 70.65,74.15 70.65,79.77 72.36,81.48 v75.97,81.48 C2.1
VCC3.3  (via drill 0.6 pad 2.18)  (1 unrouted)
  Top 1.27: v8.92,50.87 8.92,35.65 v8.76,35.49
  Bottom 1.27: 107.07,74.83 109.97,71.93 109.97,71.73 | 109.97,71.73 C7.1 | 109.97,71.73 107.02,74.68 3.3V_REG.OUT 107.02,91.39 104.05,94.36 10.8,94.36 1.07,84.63 0.91,84.63 0.6,84.32 0.6,59.19 v8.92,50.87 | C9.+ 9.7,29.26 | 9.7,29.26 13.32,29.26 | v8.76,35.49 8.76,30.2 9.7,29.26